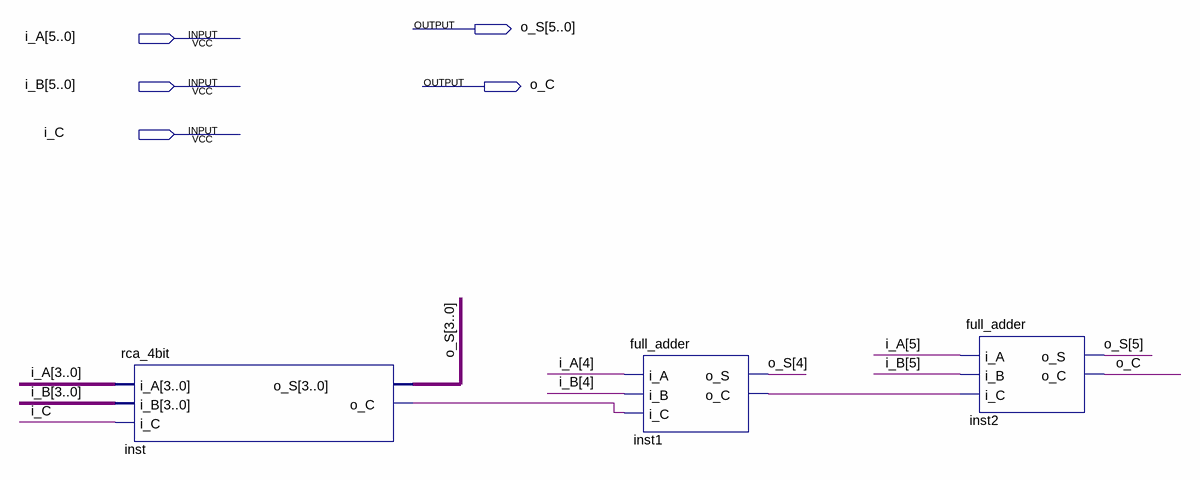
[diagram p0: schematic sheet]
// Quartus schematic rca_6bit.bdf as structural Verilog: 3 symbols, 5 pins
module rca_6bit (
  input  [5:0] i_A,
  input  [5:0] i_B,
  input  i_C,
  output [5:0] o_S,
  output o_C
);

  wire inst1_o_c, inst_o_c;

  rca_4bit inst (.i_A(i_A[3:0]), .i_B(i_B[3:0]), .i_C(i_C), .o_S(o_S[3:0]), .o_C(inst_o_c));
  full_adder inst1 (.i_A(i_A[4]), .i_B(i_B[4]), .i_C(inst_o_c), .o_S(o_S[4]), .o_C(inst1_o_c));
  full_adder inst2 (.i_A(i_A[5]), .i_B(i_B[5]), .i_C(inst1_o_c), .o_S(o_S[5]), .o_C(o_C));
endmodule
